# EAGLE design Xadow Serial (EAGLE 7.1.0)
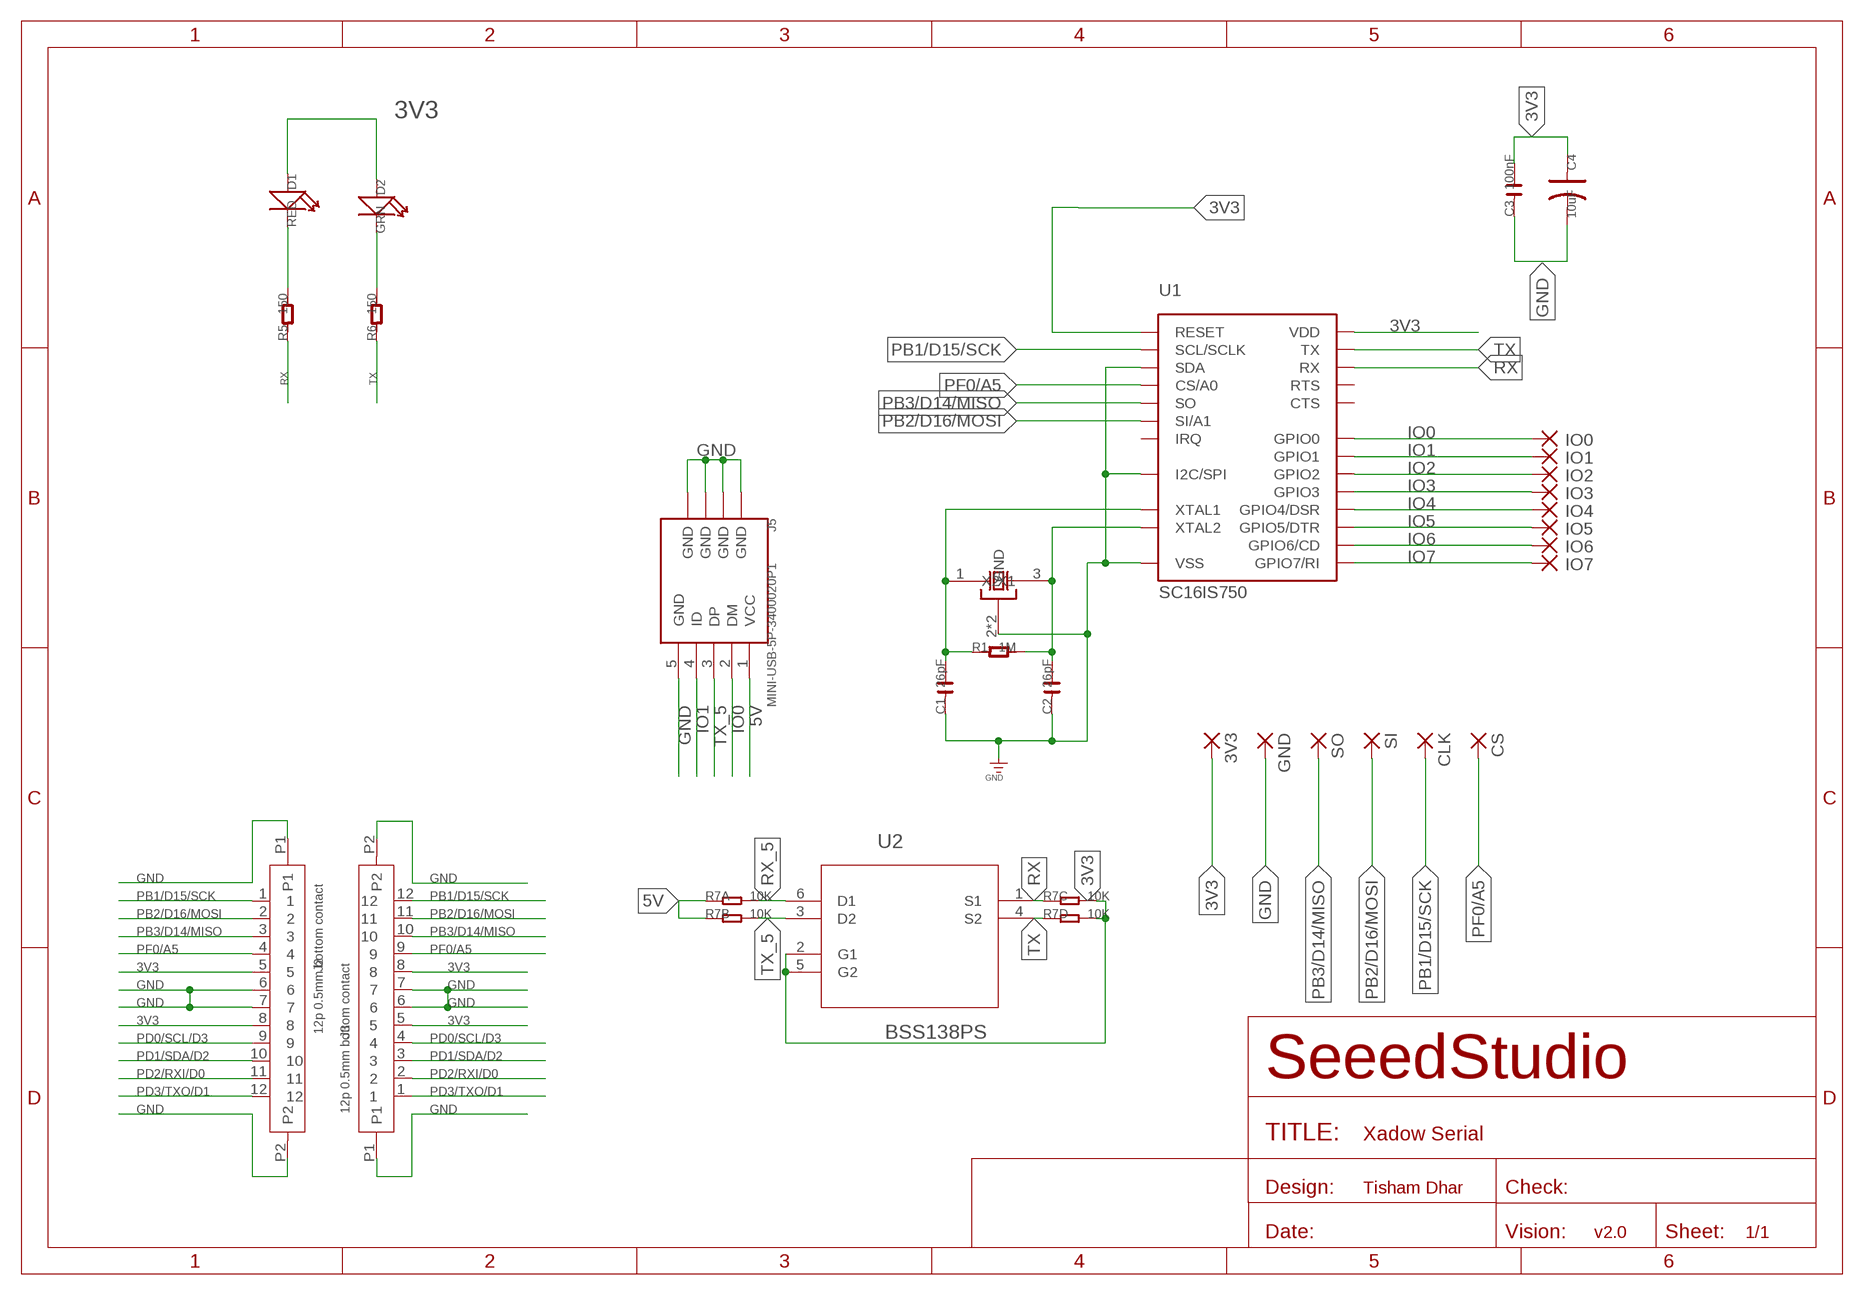
[diagram p0: schematic, sheet 1]

## Parts
3V3  WIREPADSMD1,27-254  [SMD1,27-2,54]
C1  26pF  C-0603  [C0603]
C2  26pF  C-0603  [C0603]
C3  100nF  C-0603  [C0603]
C4  10uF  C-POLAR-A  [AVX-A]
CLK  WIREPADSMD1,27-254  [SMD1,27-2,54]
CS  WIREPADSMD1,27-254  [SMD1,27-2,54]
D1  RED  LED  [LED0603]
D2  GRN  LED  [LED0603]
GND  WIREPADSMD1,27-254  [SMD1,27-2,54]
IO0  WIREPADSMD1,27-254  [SMD1,27-2,54]
IO1  WIREPADSMD1,27-254  [SMD1,27-2,54]
IO2  WIREPADSMD1,27-254  [SMD1,27-2,54]
IO3  WIREPADSMD1,27-254  [SMD1,27-2,54]
IO4  WIREPADSMD1,27-254  [SMD1,27-2,54]
IO5  WIREPADSMD1,27-254  [SMD1,27-2,54]
IO6  WIREPADSMD1,27-254  [SMD1,27-2,54]
IO7  WIREPADSMD1,27-254  [SMD1,27-2,54]
J2  12p 0.5mm bottom contact  FPC052002-12LT  [12P-0.5]
J3  12p 0.5mm bottom contact  FPC052002-12LT  [12P-0.5]
J5  MINI-USB-5P-3400020P1  [MINI-B-SMD]
R1  1M  R-0603  [R0603]
R5  150  R-0603  [R0603]
R6  150  R-0603  [R0603]
R7  10K  R-4R-1206  [1206-8-3.3X2.4]
SI  WIREPADSMD1,27-254  [SMD1,27-2,54]
SO  WIREPADSMD1,27-254  [SMD1,27-2,54]
U1  SC16IS750  [TSSOP_24]
U2  BSS138PS  [SOT65P210X110-6N]
X1  CTS_32X25_SMD  [CTS_32X25]

## Nets
3V3 [usbvcc]: 3V3.1(P) C3.2 C4.+ D1.+ D2.+ J2.5 J2.8 J3.5 J3.8 R7.5 R7.6 U1.P$4(RESET) U1.P$7(VDD) U2.2(G1) U2.5(G2)
5V [usbvcc]: J5.1(VCC) R7.1 R7.2
GND: C1.1 C2.1 C3.1 C4.- GND.1(P) J2.6 J2.7 J2.P1 J2.P2 J3.6 J3.7 J3.P1 J3.P2 J5.5(GND) J5.P$1(GND) J5.P$2(GND) J5.P$3(GND) J5.P$4(GND) U1.P$8(I2C/SPI) U1.P$13(SDA) U1.P$19(VSS) X1.2(GND) X1.4(GND)
IO0: IO0.1(P) J5.2(DM) U1.P$15(GPIO0)
IO1: IO1.1(P) J5.4(ID) U1.P$16(GPIO1)
IO2: IO2.1(P) U1.P$17(GPIO2)
IO3: IO3.1(P) U1.P$18(GPIO3)
IO4: IO4.1(P) U1.P$20(GPIO4/DSR)
IO5: IO5.1(P) U1.P$21(GPIO5/DTR)
IO6: IO6.1(P) U1.P$22(GPIO6/CD)
IO7: IO7.1(P) U1.P$23(GPIO7/RI)
N$1: C1.2 R1.1 U1.P$5(XTAL1) X1.1(X1)
N$2: C2.2 R1.2 U1.P$6(XTAL2) X1.3(X2)
N$15: D1.- R5.2
N$16: D2.- R6.2
PB1/D15/SCK: CLK.1(P) J2.1 J3.12 U1.P$12(SCL/SCLK)
PB2/D16/MOSI: J2.2 J3.11 SI.1(P) U1.P$10(SI/A1)
PB3/D14/MISO: J2.3 J3.10 SO.1(P) U1.P$11(SO)
PD0/SCL/D3: J2.9 J3.4
PD1/SDA/D2: J2.10 J3.3
PD2/RXI/D0: J2.11 J3.2
PD3/TXO/D1: J2.12 J3.1
PF0/A5: CS.1(P) J2.4 J3.9 U1.P$9(CS/A0)
RX: R5.1 R7.3 U1.P$3(RX) U2.1(S1)
RX_5: R7.8 U2.6(D1)
TX: R6.1 R7.4 U1.P$2(TX) U2.4(S2)
TX_5: J5.3(DP) R7.7 U2.3(D2)
Unconnected: U1.P$1(CTS) U1.P$14(IRQ) U1.P$24(RTS)

## Notes on the sheet
- Tisham Dhar
- v2.0

## Library data of the parts
3V3 CLK CS GND IO0 IO1-IO7 SI SO = wirepad:WIREPAD: Wire PAD connect wire on PCB
C1-C3 = OPL:C*
C4 = OPL:C-POLAR*
D1 D2 = OPL:LED*: LED
J2 J3 = template:FPC052002-12LT
J5 = Connector:MINI-USB-5P: SMD Mini USB
R1 R5 R6 = OPL:R*
R7 = Discrete:R-4R*: Resistor Array
U1 = nxpsemi:SC16IS750
U2 = NXP_By_element14_Batch_1:BSS138PS: Dual N-channel Trench MOSFET; MPN: BSS138PS; OC_FARNELL: 1972664; OC_NEWARK: 58T9002; PACKAGE: SOT-363-6; SUPPLIER: NXP
X1 = cts_crystal:CTS_32X25_SMD

## Net classes
0 default: width 0.152 mm, drill 0.305 mm, clearance 0.152 mm
1 GND: width 0.305 mm, drill 0.305 mm, clearance 0.152 mm to class 0, clearance 0.152 mm
3 usbvcc: width 0.305 mm, drill 0.305 mm, clearance 0.152 mm to class 0, clearance 0.203 mm

## Board
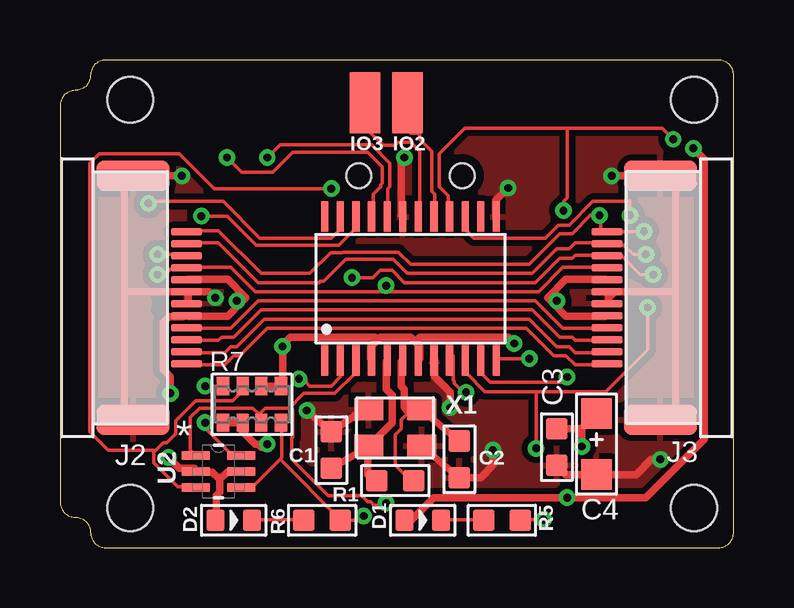
[diagram p1: board, top side]
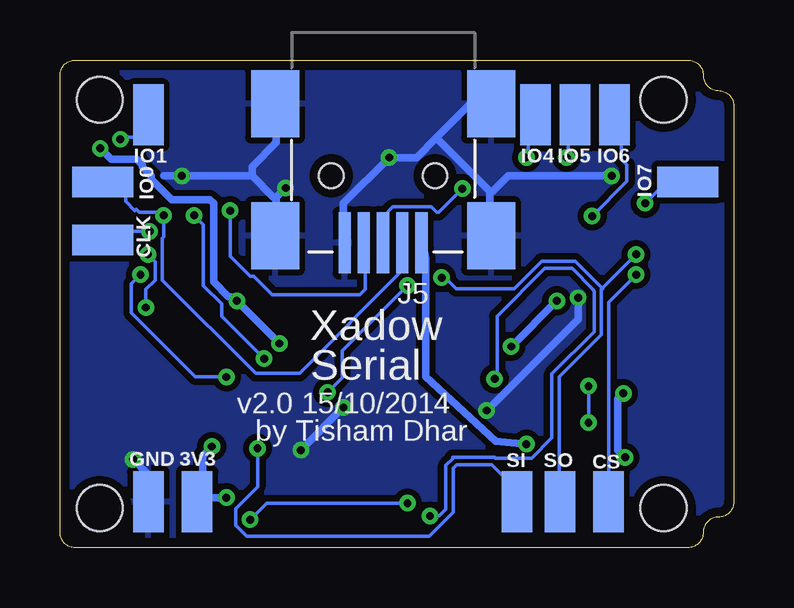
[diagram p2: board, bottom side, seen from below]

Size 28.07 x 20.32 mm. Coordinates in mm from the lower left corner, seen from the top.
Outline: 1.27,0.64 arc90 0.64,1.27 arc-90 0,1.91 0,18.42 arc-90 0.64,19.05 arc90 1.27,19.69 arc-90 1.91,20.32 27.43,20.32 arc-90 28.07,19.69 28.07,0.64 arc-90 27.43,0 1.91,0 arc-90 1.27,0.64
Outline: 1.27,0.64 1.27,0.64
Copper layers (1*16): Top 0.0356mm / dielectric 1.5011mm / Bottom 0.0356mm
Design rules "LaenPCBOrder *": minimum track width 6mil, minimum drill 13mil, track to track 6mil, track to pad 6mil, pad to pad 6mil, via to via 6mil, smd to smd 6mil, copper to edge 15mil, drill to drill 6mil, minimum pad ring 7mil, minimum via ring 7mil, stop-mask expansion 3mil, vias tented up to drill 14mil, thermal gap 10mil
Holes 1.91 mm at 2.92,1.65 2.92,18.67 26.42,18.67 26.42,1.65
tRestrict: area 23.5,9.9 to 24.1,10.4; area 4.1,9.9 to 4.6,10.4

### Footprints (pad centres in the part's own frame; a part is rotated, then mirrored left to right if it is on the bottom)
SMD1,27-2,54 = smd 1.27 x 2.54: 1 0,0
C0603 = smd 0.889 x 0.889: 1 -0.762,0; 2 0.762,0
AVX-A = smd 1.27 x 1.27: + -1.27,0; - 1.27,0
LED0603 = smd 0.762 x 0.889: + -0.762,0; - 0.762,0
12P-0.5 = smd 0.3 x 1.3: 1 -2.75,2.35; 2 -2.25,2.35; 3 -1.75,2.35; 4 -1.25,2.35; 5 -0.75,2.35; 6 -0.25,2.35; 7 0.25,2.35; 8 0.75,2.35; 9 1.25,2.35; 10 1.75,2.35; 11 2.25,2.35; 12 2.75,2.35 | smd 1.27 x 3.048: P1 -5.08,0.127; P2 5.08,0.127
MINI-B-SMD = smd 0.508 x 2.54: 1 -1.6,4.191; 2 -0.8,4.191; 3 0,4.191; 4 0.8,4.191; 5 1.6,4.191 | smd 2 x 2.794: P$1 4.5,-1.603; P$2 -4.5,-1.603; P$3 4.5,3.897; P$4 -4.5,3.897 | hole 1.016: -2.159,1.397; 2.159,1.397
R0603 = smd 0.889 x 0.889: 1 -0.762,0; 2 0.762,0
1206-8-3.3X2.4 = smd 0.508 x 0.762: 1 -1.206,-0.762; 2 -0.381,-0.762; 3 0.381,-0.762; 4 1.206,-0.762; 5 1.206,0.762; 6 0.381,0.762; 7 -0.381,0.762; 8 -1.206,0.762
TSSOP_24 = smd 0.3 x 1.27: P$1 -3.575,-3; P$2 -2.925,-3; P$3 -2.275,-3; P$4 -1.625,-3; P$5 -0.975,-3; P$6 -0.325,-3; P$7 0.325,-3; P$8 0.975,-3; P$9 1.625,-3; P$10 2.275,-3; P$11 2.925,-3; P$12 3.575,-3; P$13 3.575,3; P$14 2.925,3; P$15 2.275,3; P$16 1.625,3; P$17 0.975,3; P$18 0.325,3; P$19 -0.325,3; P$20 -0.975,3; P$21 -1.625,3; P$22 -2.275,3; P$23 -2.925,3; P$24 -3.575,3
SOT65P210X110-6N = smd 1.168 x 0.356: 1 -0.94,0.66; 2 -0.94,0; 3 -0.94,-0.66; 4 0.94,-0.66; 5 0.94,0; 6 0.94,0.66
CTS_32X25 = smd 1.2 x 0.9: 1 -1.1,-0.7; 2 1.1,-0.7; 3 1.1,0.8; 4 -1.1,0.8

### Placement (x,y rotation side)
3V3  22.35,1.91 0 bottom
C1  11.3,4.06 270 top
C2  16.64,3.68 90 top
C3  20.7,4.19 90 top
C4  22.35,4.32 270 top
CLK  26.29,12.83 90 bottom
CS  5.21,1.91 180 bottom
D1  15.11,1.14 0 top
D2  7.24,1.14 0 top
GND  24.38,1.91 0 bottom
IO0  26.29,15.24 90 bottom
IO1  24.38,18.03 0 bottom
IO2  14.48,18.54 180 top
IO3  12.7,18.54 180 top
IO4  8.25,18.03 180 bottom
IO5  6.6,18.03 180 bottom
IO6  4.95,18.03 180 bottom
IO7  1.91,15.24 90 bottom
J2  2.92,10.41 270 top
J3  25.15,10.41 90 top
J5  14.6,16.89 180 bottom
R1  13.97,2.79 0 top
R5  18.42,1.14 180 top
R6  10.92,1.14 180 top
R7  8,5.97 0 top
SI  9.02,1.91 180 bottom
SO  7.24,1.91 180 bottom
U1  14.6,10.8 0 top
U2  6.6,3.18 0 top
X1  13.97,4.95 0 top

### Tracks (layer width: path | path; a pad name or v marks a point on that pad's centre or on a via)
3V3  (via drill 0.33)
  Top 0.305: J3.8 22.73,11.18 21.08,11.18 20.32,10.41 20.64,10.1 | 20.64,10.1 21.08,9.65 22.73,9.65 J3.5 | 7.56,10.22 6.99,9.65 5.33,9.65 J2.8 5.13,9.63 4.52,9.63 4.29,9.4 4.29,7.42 4.6,7.11 v4.6,6.43 | 7.56,10.22 7.75,10.41 6.99,11.18 5.33,11.18 J2.5 | 14.79,8.57 14.99,8.38 14.99,7.87 U1.P$7 | 14.79,8.57 14.6,8.76 13.33,8.76 13.23,8.66 | 13.23,8.66 12.95,8.38 12.95,7.87 U1.P$4 | v20.7,10.29 20.7,10.16 20.64,10.1 | v18.92,8.51 18.67,8.76 14.99,8.76 14.79,8.57 | 21.72,4.95 C4.+ | C3.2 21.72,4.95 | R7.6 R7.5 9.27,6.86 v9.27,8.38 9.35,8.51 9.6,8.76 13.13,8.76 13.23,8.66 | v7.37,10.29 7.49,10.29 7.56,10.22 | D1.+ 14.35,1.17 14.66,1.17 15.57,2.08 v21.13,2.08 24.41,2.08 26.85,4.52 26.85,16.18 v26.39,16.64 | v21.74,4.22 21.74,4.83 21.72,4.95 | 6.66,2.85 6.66,2.31 6.5,2.16 6.5,1.17 D2.+ | 6.66,2.85 6.96,3.15 7.49,3.15 U2.5 | 6.66,2.85 6.35,3.15 5.66,3.15 U2.2 5.59,3.3 4.98,3.3 v4.52,3.76
  Bottom 0.305: v18.92,8.51 v20.7,10.29 20.75,10.39 20.9,10.39 20.98,10.47 21.06,10.47 21.67,11.07 21.67,14.35 21.82,14.5 23.42,14.5 24.26,15.34 24.26,15.49 24.64,15.88 24.64,15.95 24.87,16.18 25.93,16.18 v26.39,16.64 | v7.37,10.29 v9.27,8.38 | v21.13,2.08 22.2,2.08 22.35,1.93 3V3.1 22.12,2.16 22.12,3.84 v21.74,4.22 | v4.52,3.76 4.83,4.06 4.83,6.2 v4.6,6.43
5V  (via drill 0.33)
  Top 0.305: R7.1 6.73,5.21 6.86,5.08 6.99,5.21 R7.2 7.62,4.83 8.13,4.32 8.25,4.32 8.38,4.19 8.51,4.19 v8.64,4.32
  Bottom 0.305: J5.1 12.95,12.7 12.83,12.07 12.83,7.11 9.91,4.45 v8.64,4.32
GND  (via drill 0.33)
  Top 0.305: J2.6 5.33,10.54 5.33,10.29 J2.7 | 2.67,10.67 5.21,10.67 J2.6 | 2.67,10.67 2.67,15.37 2.79,15.49 J2.P1 v5.08,15.49 | 2.67,10.67 2.67,5.46 2.79,5.33 J2.P2 | J3.6 22.86,10.29 22.86,10.54 J3.7 22.99,10.54 23.11,10.67 25.65,10.67 | 25.65,10.67 25.65,15.37 25.53,15.49 J3.P2 v22.99,15.49 | 25.15,5.33 J3.P1 25.53,5.33 25.65,5.46 25.65,10.67 | 25.15,3.68 v25.02,3.68 24.64,3.68 24,3.05 C4.- 21.08,3.05 C3.1 | v18.67,14.99 18.16,14.48 18.16,13.84 U1.P$13 | U1.P$19 14.22,13.84 14.22,16.26 v14.35,16.26 | 12.7,5.72 X1.4 12.57,5.72 C1.1 v10.29,5.72 | X1.2 15.11,4.19 C2.1 17.53,2.92 18.03,3.43 v18.03,4.06 | v6.48,10.41 6.22,10.67 5.33,10.67 J2.6 | v16.26,5.84 16.26,6.48 15.62,7.11 15.62,7.75 U1.P$8
  Bottom 0.305: v25.02,3.68 24.38,3.05 GND.1 | 19.05,14.61 19.05,13.08 J5.P$3 | v18.67,14.99 19.05,14.61 | 20.07,15.49 v22.99,15.49 23.75,15.49 | 20.07,15.49 19.18,14.61 19.05,14.61 | J5.5 16.26,12.7 16.26,14.35 v14.35,16.26 13.21,16.26 12.38,17.08 | 20.07,15.49 20.07,15.88 19.05,16.89 19.05,18.42 J5.P$1 | 12.38,17.08 10.92,18.54 10.29,18.54 10.16,18.67 10.03,18.54 J5.P$2 | 10.16,14.86 12.38,17.08 | 10.16,14.86 10.16,13.08 J5.P$4 | 4.95,15.49 v5.08,15.49 9.4,15.49 10.03,14.86 10.16,14.86 | v6.48,10.41 6.48,9.53 v10.29,5.72 | v16.26,5.84 v18.03,4.06
  pour Top (isolate 0.254): 0,0 28.07,0 28.07,20.32 0,20.32
  pour Bottom (isolate 0.254): 0,0 28.07,0 28.07,20.32 0,20.32
IO0  (via drill 0.33)
  Top 0.152: 23.75,14.43 22.2,14.43 21.21,13.44 20.75,13.44 20.22,12.9 17.25,12.9 16.94,13.21 16.94,13.74 U1.P$15 | 23.75,14.48 23.75,14.43 | v23.75,13.84 23.75,14.43
  Bottom 0.152: IO0.1 26.24,15.19 25.86,15.19 25.32,14.66 25.32,14.43 24.94,14.05 24.89,14.1 24.77,13.97 23.88,13.97 v23.75,13.84 23.75,12.95 23.8,12.9 23.8,11.15 19.91,7.26 18.09,7.26 13.82,11.53 13.82,12.68 J5.2
IO1  (via drill 0.33)
  Top 0.152: 21.13,17.48 25.1,17.48 v25.55,17.02 | 21.13,17.48 16.87,17.48 15.8,16.41 15.8,15.04 16.18,14.66 16.18,13.82 U1.P$16 | v20.98,14.05 20.98,14.43 21.13,14.58 21.13,17.48
  Bottom 0.152: v25.55,17.02 25.48,16.94 25.4,16.94 25.25,17.09 24.94,17.09 24.41,17.63 24.41,18.01 IO1.1 | v20.98,14.05 20.98,12.14 20.14,11.3 19.99,11.3 19.23,10.54 15.57,10.54 15.34,10.77 15.34,12.68 J5.4
IO2
  Top 0.152: IO2.1 14.48,17.4 14.6,17.27 14.99,17.27 14.99,17.02 15.49,16.51 15.49,14.86 15.62,14.73 15.62,13.84 U1.P$17
IO3
  Top 0.152: IO3.1 12.7,17.53 13.46,16.76 13.97,16.76 14.1,16.89 14.6,16.89 14.99,16.51 14.99,13.84 U1.P$18
IO4  (via drill 0.33)
  Top 0.152: v8.64,16.26 9.17,16.79 12.98,16.79 13.74,16.03 13.74,15.04 13.66,14.96 13.66,13.82 U1.P$20
  Bottom 0.152: v8.64,16.26 8.56,16.33 8.56,17.7 8.25,18.01 IO4.1
IO5  (via drill 0.33)
  Top 0.152: v6.96,16.26 7.57,15.65 8.87,15.65 9.7,16.49 12.83,16.49 13.44,15.88 13.44,15.19 13.36,15.11 13.36,15.04 13.06,14.73 13.06,13.82 U1.P$21
  Bottom 0.152: v6.96,16.26 6.88,16.33 6.88,17.78 6.66,18.01 IO5.1
IO6  (via drill 0.33)
  Top 0.152: v5.89,13.82 6.96,13.82 8.18,12.6 11.61,12.6 12.29,13.28 12.29,13.74 U1.P$22
  Bottom 0.152: v5.89,13.82 4.45,15.27 4.45,15.95 4.67,16.18 4.67,17.78 4.9,18.01 IO6.1
IO7  (via drill 0.33)
  Top 0.152: v3.68,14.35 3.76,14.43 6.81,14.43 8.33,12.9 11.3,12.9 11.61,13.21 11.61,13.74 U1.P$23
  Bottom 0.152: v3.68,14.35 2.84,15.19 1.93,15.19 IO7.1
N$1
  Top 0.305: C1.2 12.83,4.19 X1.1 | R1.1 13.08,2.79 12.83,3.05 12.83,4.06 X1.1 | U1.P$5 13.59,7.75 13.59,6.6 13.84,6.35 13.84,5.21 12.95,4.32 X1.1
N$2
  Top 0.152: R1.2 14.6,2.79 13.97,3.43 13.97,4.7 14.22,4.95 14.22,5.33 14.48,5.59 X1.3
  Top 0.305: U1.P$6 14.22,7.75 14.22,6.73 14.35,6.6 14.35,5.84 14.48,5.72 14.99,5.72 X1.3 15.11,5.72 C2.2
N$15
  Top 0.152: D1.- 15.87,1.17 17.63,1.17 R5.2
N$16
  Top 0.152: D2.- 8.03,1.17 10.16,1.17 R6.2
PB1/D15/SCK  (via drill 0.33)
  Top 0.152: v19.56,7.87 18.29,7.87 U1.P$12 | J2.1 5.33,13.21 6.6,13.21 8.38,11.43 10.41,11.43 11.28,12.29 11.76,12.29 11.81,12.32 14.1,12.32 14.6,11.81 19.56,11.81 20.83,13.08 21.34,13.08 22.1,13.84 v22.48,13.84 22.53,13.79 22.53,13.16 J3.12 22.86,13.16 24.33,13.16 v24.33,13.18
  Bottom 0.152: v22.48,13.84 22.1,13.46 22.1,10.92 21.34,10.16 21.34,9.65 v19.56,7.87 | v24.33,13.18 25.22,13.18 25.58,12.83 CLK.1
PB2/D16/MOSI  (via drill 0.33)
  Top 0.152: 19.84,6.5 22.73,6.5 24.49,8.26 v24.49,10.01 | 19.84,6.5 17.7,6.5 16.94,7.26 16.94,7.72 U1.P$10 | v24.41,12.22 23.88,12.22 23.5,12.6 22.81,12.6 J3.11 22.73,12.7 21.46,12.7 21.21,12.45 20.7,12.45 19.69,11.43 14.48,11.43 13.89,12.01 11.91,12.01 11,11.1 10.85,11.1 10.79,11.05 8.25,11.05 6.6,12.7 5.33,12.7 J2.2 | 19.84,6.5 v19.84,4.14
  Bottom 0.152: v24.49,10.01 24.49,10.77 24.11,11.15 24.11,11.91 v24.41,12.22 | SI.1 9.02,2.39 10.08,3.45 11.53,3.45 11.68,3.3 11.68,1.47 12.67,0.48 20.3,0.48 20.75,0.94 20.75,1.63 19.84,2.54 v19.84,4.14
PB3/D14/MISO  (via drill 0.33)
  Top 0.152: v21.13,7.11 20.9,6.88 17.93,6.88 17.55,7.26 17.55,7.72 U1.P$11 | v24.71,11.38 24.18,11.38 23.42,12.14 22.81,12.14 J3.10 22.73,12.19 21.46,12.19 21.34,12.07 20.83,12.07 19.81,11.05 14.35,11.05 13.84,11.56 13.33,11.56 13.03,11.25 v12.17,11.25 | v4.06,12.22 5.21,12.22 J2.3
  Bottom 0.152: v21.13,7.11 22.43,7.11 25.1,9.78 25.1,11 v24.71,11.38 | 5.51,10.77 5.51,8.87 7.26,7.11 7.26,1.93 SO.1 | v4.06,12.22 5.51,10.77 | 5.51,10.77 5.46,10.8 6.6,11.94 8,11.94 9.14,10.8 11.56,10.8 12.01,11.25 v12.17,11.25
PD0/SCL/D3
  Top 0.152: J2.9 5.33,9.14 7.11,9.14 8.25,10.29 19.81,10.29 20.96,9.14 22.73,9.14 J3.4
PD1/SDA/D2
  Top 0.152: J2.10 5.33,8.64 6.6,8.64 6.73,8.76 7.24,8.76 8.38,9.91 19.69,9.91 20.83,8.76 21.34,8.76 21.46,8.64 22.73,8.64 J3.3
PD2/RXI/D0
  Top 0.152: J2.11 5.33,8.13 6.86,8.13 7.11,8.38 7.37,8.38 8.51,9.53 19.56,9.53 20.7,8.38 21.21,8.38 21.46,8.13 22.73,8.13 J3.2
PD3/TXO/D1
  Top 0.152: J2.12 5.33,7.62 6.86,7.62 7.24,8 7.49,8 8.64,9.14 19.43,9.14 20.57,8 21.08,8 21.46,7.62 22.73,7.62 J3.1
PF0/A5  (via drill 0.33)
  Top 0.152: 13.59,10.67 8.13,10.67 7.11,11.68 5.33,11.68 J2.4 5.21,11.61 4.6,11.61 4.37,11.38 v4.06,11.38 | 13.59,10.67 19.94,10.67 20.96,11.68 22.73,11.68 J3.9 | U1.P$9 16.13,7.87 16.26,8 16.38,8 16.38,6.99 16.43,6.93 16.43,6.86 16.82,6.48 v16.92,6.48 | 13.59,10.67 v13.59,10.92
  Bottom 0.152: CS.1 5.21,10.24 v4.06,11.38 | v13.59,10.92 16.31,8.2 16.31,7.09 v16.92,6.48
RX  (via drill 0.33)
  Top 0.152: 8.29,5.55 8.03,5.82 5.82,5.82 5.44,5.44 5.44,4.06 U2.1 | 8.29,5.55 8.33,5.51 8.33,5.21 R7.3 | v20.14,1.17 19.23,1.17 R5.1 | 9.55,5.82 8.56,5.82 8.29,5.55 | 9.55,5.82 9.63,5.82 9.7,5.74 9.7,4.6 9.65,4.57 9.65,3.68 11.18,2.16 12.57,2.16 12.83,1.91 12.95,1.91 13.08,1.78 13.59,1.78 v13.59,1.85 | 9.55,5.82 10.16,6.43 11.46,6.43 12.29,7.26 12.29,7.72 U1.P$3
  Bottom 0.152: v20.14,1.17 19.46,1.85 v13.59,1.85
RX_5  (via drill 0.33)
  Top 0.152: v6.04,6.73 R7.8 | v6.04,5.21 6.04,4.98 7.19,3.84 U2.6
  Bottom 0.152: v6.04,5.21 v6.04,6.73
TX  (via drill 0.33)
  Top 0.152: 9.17,3.68 8.03,2.54 7.57,2.54 U2.4 | 9.17,3.68 9.25,3.76 9.25,5.21 R7.4 | 9.17,3.68 11.68,1.17 R6.1 12.47,1.14 v12.65,1.32 | 11.61,8.33 11.61,7.8 U1.P$2 11.68,7.75 11.68,7.11 11.3,6.73 10.41,6.73 10.21,6.93 10.26,6.99 10.21,7.04 v9.96,7.04
  Bottom 0.152: v9.96,7.04 9.85,7.14 9.85,9.65 7.87,11.63 6.73,11.63 5.84,10.74 5.84,10.72 5.82,10.69 5.82,8.99 7.57,7.24 7.57,4.57 8.41,3.73 9.93,3.73 9.96,3.76 11.71,3.76 11.71,3.71 11.99,3.43 11.99,1.6 12.27,1.32 v12.65,1.32
TX_5  (via drill 0.33)
  Top 0.152: 3.95,4.03 3.91,3.99 3.91,3.53 4.9,2.54 5.66,2.54 U2.3 | 3.95,4.03 4.29,4.37 4.45,4.37 4.83,4.75 4.83,5.28 5.66,6.12 7.19,6.12 7.57,6.5 7.57,6.73 R7.7 | v11.3,14.96 6.43,14.96 4.98,16.41 1.63,16.41 1.25,16.03 1.25,4.83 2.01,4.06 3.91,4.06 3.95,4.03
  Bottom 0.152: v11.3,14.96 12.29,13.97 12.37,13.97 12.6,14.2 14.2,14.2 14.58,13.82 14.58,12.75 J5.3

### Text on the board
bPlace: Xadow | Serial | v2.0 15/10/2014 | by Tisham Dhar
dxf: Unit:mm